# Altium schematic sheet Moway IR.SchDoc: Moway IR
size A3; Date: <>; CheckedBy: <>; DrawnBy: <>; Organization: Bizintek Innova S.L.; DocumentNumber: 2; Revision: V2; SheetNumber: 2; SheetTotal: 2; PageSetup: Record=PageOptions|CenterHorizontal=True|CenterVertical=True|PrintScale=1.00|XCorrection=1.00|YCorrection=1.00|PrintKind=0|BorderSize=5000000|LeftOffset=0|BottomOffset=0|Orientation=2|PaperLength=1000|PaperWidth=1000|Scale=100|PaperSource=7|PrintQuality=-3|MediaType=1|DitherType=10|PrintScaleMode=0|PaperKind=A4|PaperIndex=9; ProjectName: <Nombre Proyecto>
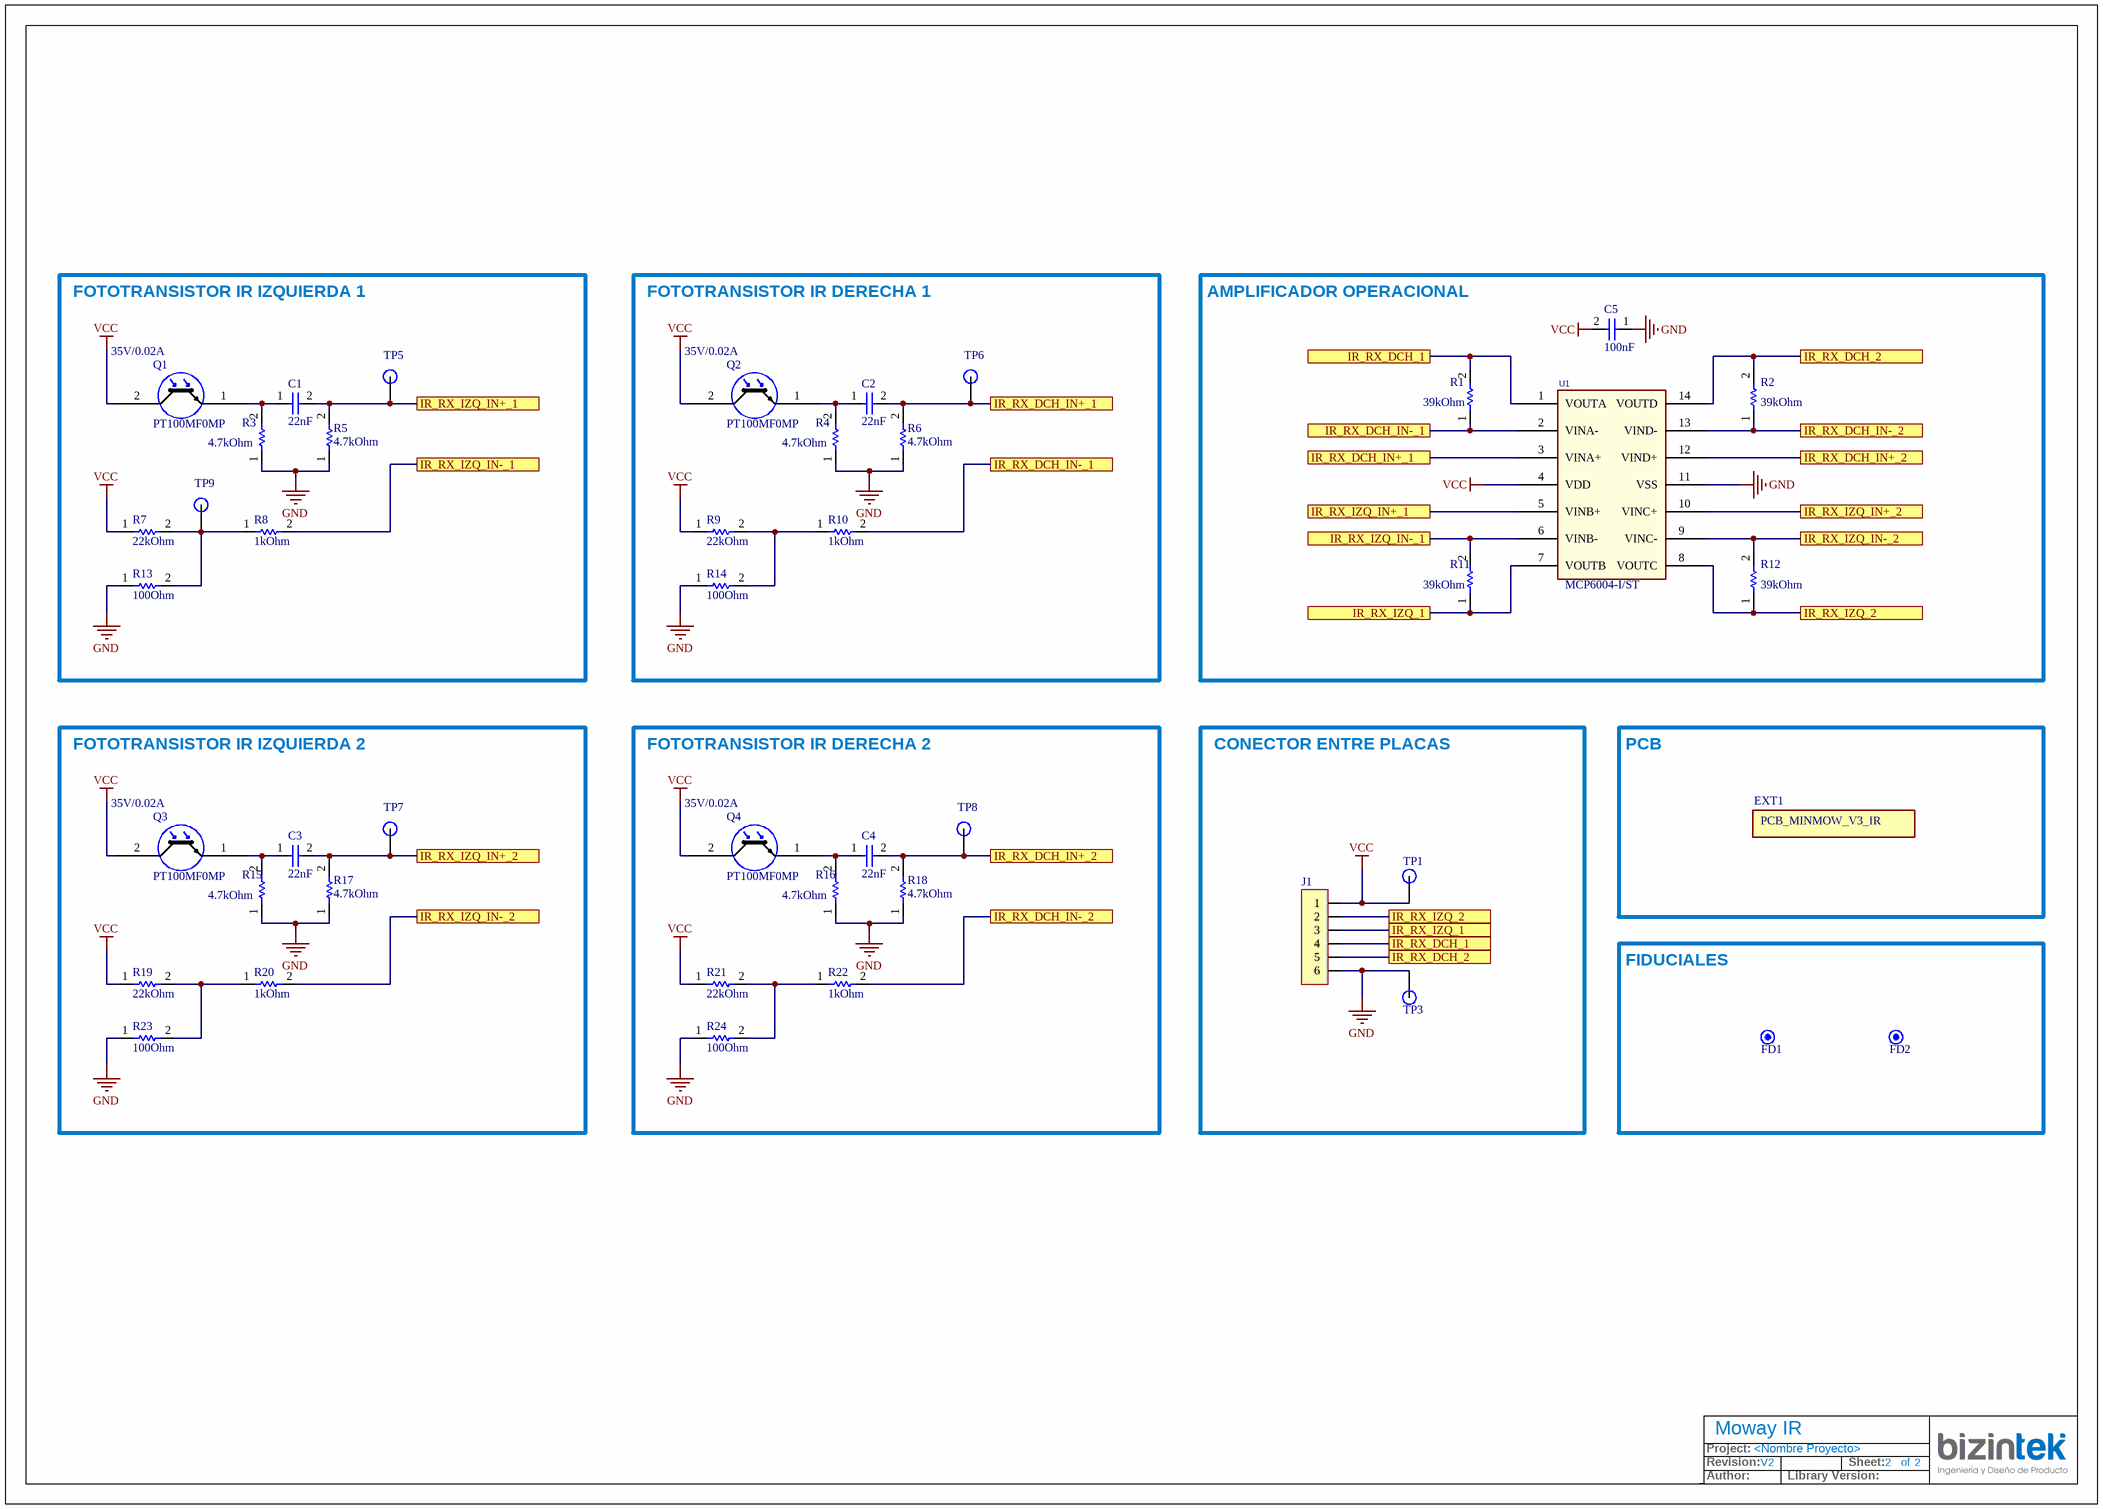
[diagram p0: Moway IR.SchDoc]

## Parts
C1  value 22nF  [C0603]  (hidden comment: C22NV10X7R0603)
C2  value 22nF  [C0603]  (hidden comment: C22NV10X7R0603)
C3  value 22nF  [C0603]  (hidden comment: C22NV10X7R0603)
C4  value 22nF  [C0603]  (hidden comment: C22NV10X7R0603)
C5  value 100nF  [C0603]  (hidden comment: C100NV10X7R0603)
EXT1  PCB_MINMOW_V3_IR  (mechanical)
FD1  FIDUCIAL  [FIDUCIAL]  (value not drawn)  (no BOM)
FD2  FIDUCIAL  [FIDUCIAL]  (value not drawn)  (no BOM)
J1  PAD_6PIN_3X2_1.05MM_1.27MM_PITCH  [PAD_6PIN_3X2_1.05MM_1.27MM_PITCH]  (value not drawn)  (no BOM)
Q1  value 35V/0.02A  [PT100MF0MP_SIDE]  (hidden comment: PT100MF0MP)
Q2  value 35V/0.02A  [PT100MF0MP_SIDE]  (hidden comment: PT100MF0MP)
Q3  value 35V/0.02A  [PT100MF0MP_SIDE]  (hidden comment: PT100MF0MP)
Q4  value 35V/0.02A  [PT100MF0MP_SIDE]  (hidden comment: PT100MF0MP)
R1  value 39kOhm  [R0402]  (hidden comment: R39KT10402)
R2  value 39kOhm  [R0402]  (hidden comment: R39KT10402)
R3  value 4.7kOhm  [R0402]  (hidden comment: R4K7T10402)
R4  value 4.7kOhm  [R0402]  (hidden comment: R4K7T10402)
R5  value 4.7kOhm  [R0402]  (hidden comment: R4K7T10402)
R6  value 4.7kOhm  [R0402]  (hidden comment: R4K7T10402)
R7  value 22kOhm  [R0402]  (hidden comment: R22KT10402)
R8  value 1kOhm  [R0402]  (hidden comment: R1KT10402)
R9  value 22kOhm  [R0402]  (hidden comment: R22KT10402)
R10  value 1kOhm  [R0402]  (hidden comment: R1KT10402)
R11  value 39kOhm  [R0402]  (hidden comment: R39KT10402)
R12  value 39kOhm  [R0402]  (hidden comment: R39KT10402)
R13  value 100Ohm  [R0402]  (hidden comment: R100T10402)
R14  value 100Ohm  [R0402]  (hidden comment: R100T10402)
R15  value 4.7kOhm  [R0402]  (hidden comment: R4K7T10402)
R16  value 4.7kOhm  [R0402]  (hidden comment: R4K7T10402)
R17  value 4.7kOhm  [R0402]  (hidden comment: R4K7T10402)
R18  value 4.7kOhm  [R0402]  (hidden comment: R4K7T10402)
R19  value 22kOhm  [R0402]  (hidden comment: R22KT10402)
R20  value 1kOhm  [R0402]  (hidden comment: R1KT10402)
R21  value 22kOhm  [R0402]  (hidden comment: R22KT10402)
R22  value 1kOhm  [R0402]  (hidden comment: R1KT10402)
R23  value 100Ohm  [R0402]  (hidden comment: R100T10402)
R24  value 100Ohm  [R0402]  (hidden comment: R100T10402)
TP1  TEST_POINT_1MM  [TEST_POINT_1MM]  (value not drawn)  (no BOM)
TP3  TEST_POINT_1MM  [TEST_POINT_1MM]  (value not drawn)  (no BOM)
TP5  TEST_POINT_1MM  [TEST_POINT_1MM]  (value not drawn)  (no BOM)
TP6  TEST_POINT_1MM  [TEST_POINT_1MM]  (value not drawn)  (no BOM)
TP7  TEST_POINT_1MM  [TEST_POINT_1MM]  (value not drawn)  (no BOM)
TP8  TEST_POINT_1MM  [TEST_POINT_1MM]  (value not drawn)  (no BOM)
TP9  TEST_POINT_1MM  [TEST_POINT_1MM]  (value not drawn)  (no BOM)
U1  Manufacturer Part Number: MCP6004-I/ST  [TSSOP14_MCP]  (hidden comment: MCP6004IST)

## Blocks framed on the sheet
FOTOTRANSISTOR IR IZQUIERDA 1: C1 Q1 R3 R5 R7 R8 R13 TP5 TP9
FOTOTRANSISTOR IR DERECHA 1: C2 Q2 R4 R6 R9 R10 R14 TP6
AMPLIFICADOR OPERACIONAL: C5 R1 R2 R11 R12 U1
FOTOTRANSISTOR IR IZQUIERDA 2: C3 Q3 R15 R17 R19 R20 R23 TP7
FOTOTRANSISTOR IR DERECHA 2: C4 Q4 R16 R18 R21 R22 R24 TP8
CONECTOR ENTRE PLACAS: J1 TP1 TP3
PCB: EXT1
FIDUCIALES: FD1 FD2

## Ports
IR_RX_DCH_1, IR_RX_DCH_2, IR_RX_DCH_IN+_1, IR_RX_DCH_IN+_2, IR_RX_DCH_IN-_1, IR_RX_DCH_IN-_2, IR_RX_IZQ_1, IR_RX_IZQ_2, IR_RX_IZQ_IN+_1, IR_RX_IZQ_IN+_2, IR_RX_IZQ_IN-_1, IR_RX_IZQ_IN-_2

## Nets
GND: C5.1 J1.6 R3.1 R4.1 R5.1 R6.1 R13.1 R14.1 R15.1 R16.1 R17.1 R18.1 R23.1 R24.1 TP3.1 U1.11(VSS)
VCC: C5.2 J1.1 Q1.2 Q2.2 Q3.2 Q4.2 R7.1 R9.1 R19.1 R21.1 TP1.1 U1.4(VDD)
IR_RX_DCH_1: J1.4 R1.2 U1.1(VOUTA) ; port IR_RX_DCH_1
IR_RX_DCH_2: J1.5 R2.2 U1.14(VOUTD) ; port IR_RX_DCH_2
IR_RX_DCH_IN+_1: C2.2 R6.2 TP6.1 U1.3(VINA+) ; port IR_RX_DCH_IN+_1
IR_RX_DCH_IN+_2: C4.2 R18.2 TP8.1 U1.12(VIND+) ; port IR_RX_DCH_IN+_2
IR_RX_DCH_IN-_1: R1.1 R10.2 U1.2(VINA-) ; port IR_RX_DCH_IN-_1
IR_RX_DCH_IN-_2: R2.1 R22.2 U1.13(VIND-) ; port IR_RX_DCH_IN-_2
IR_RX_IZQ_1: J1.3 R11.1 U1.7(VOUTB) ; port IR_RX_IZQ_1
IR_RX_IZQ_2: J1.2 R12.1 U1.8(VOUTC) ; port IR_RX_IZQ_2
IR_RX_IZQ_IN+_1: C1.2 R5.2 TP5.1 U1.5(VINB+) ; port IR_RX_IZQ_IN+_1
IR_RX_IZQ_IN+_2: C3.2 R17.2 TP7.1 U1.10(VINC+) ; port IR_RX_IZQ_IN+_2
IR_RX_IZQ_IN-_1: R8.2 R11.2 U1.6(VINB-) ; port IR_RX_IZQ_IN-_1
IR_RX_IZQ_IN-_2: R12.2 R20.2 U1.9(VINC-) ; port IR_RX_IZQ_IN-_2
NetC1_1: C1.1 Q1.1 R3.2
NetC2_1: C2.1 Q2.1 R4.2
NetC3_1: C3.1 Q3.1 R15.2
NetC4_1: C4.1 Q4.1 R16.2
NetR7_2: R7.2 R8.1 R13.2 TP9.1
NetR9_2: R9.2 R10.1 R14.2
NetR19_2: R19.2 R20.1 R23.2
NetR21_2: R21.2 R22.1 R24.2

## Notes on the sheet
- Project:
- Revision:
- Author:
- Library Version:
- Sheet:
- of

## Library data of the parts
C1-C4 = C22NV10X7R0603: CAPACITOR SMD 0603, 22nF , 10V, X7R; Voltage: 10; Type: Passive/Capacitor; Part Number: C22NV10X7R0603; Dielectric: X7R
C5 = C100NV10X7R0603: CAPACITOR SMD 0603, 100nF, 10V, X7R; Voltage: 10; Type: Passive/Capacitor; Part Number: C100NV10X7R0603; Dielectric: X7R
EXT1 = PCB: Part Number: PCB; Manufacturer: BIZINTEK; Manufacturer Part Number: PCB_MINMOW_V2_IR; Type: Miscellaneous
Q1-Q4 = PT100MF0MP_S: SMT Phototransistor, 15º angle, 910nm, 3.45mA (SIDE MOUNTING); Manufacturer: SHARP; Type: Transistor/Photo; Current: 0.02; Voltage: 35; Part Number: PT100MF0MP_S; Manufacturer Part Number: PT100MF0MP; Supplier 1: Mouser; Supplier 2: Digikey; Supplier Part Number 1: 852-PT100MF0MP; Supplier Part Number 2: 425-1006-1-ND
R1 R2 R11 R12 = R39KT10402: RESISTOR SMD 0402, 39kOhm, 1%; Tolerance: 1; Part Number: R39KT10402; Type: Passive/Resistor
R3-R6 R15-R18 = R4K7T10402: RESISTOR SMD 0402, 4.7kOhm, 1%; Tolerance: 1; Part Number: R4K7T10402; Type: Passive/Resistor
R7 R9 R19 R21 = R22KT10402: RESISTOR SMD 0402, 22kOhm, 1%; Tolerance: 1; Part Number: R22KT10402; Type: Passive/Resistor
R8 R10 R20 R22 = R1KT10402: RESISTOR SMD 0402, 1kOhm, 1%; Tolerance: 1; Part Number: R1KT10402; Type: Passive/Resistor
R13 R14 R23 R24 = R100T10402: RESISTOR SMD 0402, 100Ohm, 1%; Tolerance: 1; Part Number: R100T10402; Type: Passive/Resistor
U1 = MCP6004IST: 1MHz Low-Power Op Amp; Manufacturer: MICROCHIP; Part Number: MCP6004IST; Supplier 1: Digikey; Supplier Part Number 1: MCP6004-I/ST-ND; Supplier 2: Mouser; Supplier Part Number 2: 579-MCP6004-I/ST; Type: Operational Amplifier
FD1 FD2 = FIDUCIAL: Part Number: FIDUCIAL; Type: Miscellaneous
J1 = PAD_6PIN_3X2_1.05MM_1.27MM_PITCH: Part Number: PAD_6PIN_3X2_1.05MM_1.27MM_PITCH; Type: Miscellaneous
TP1 TP3 TP5-TP9 = TEST_POINT_1MM: Part Number: TEST_POINT_1MM; Type: Miscellaneous